# EAGLE design Geoffrey's Holiday Ornament Design (EAGLE 8.4.0)
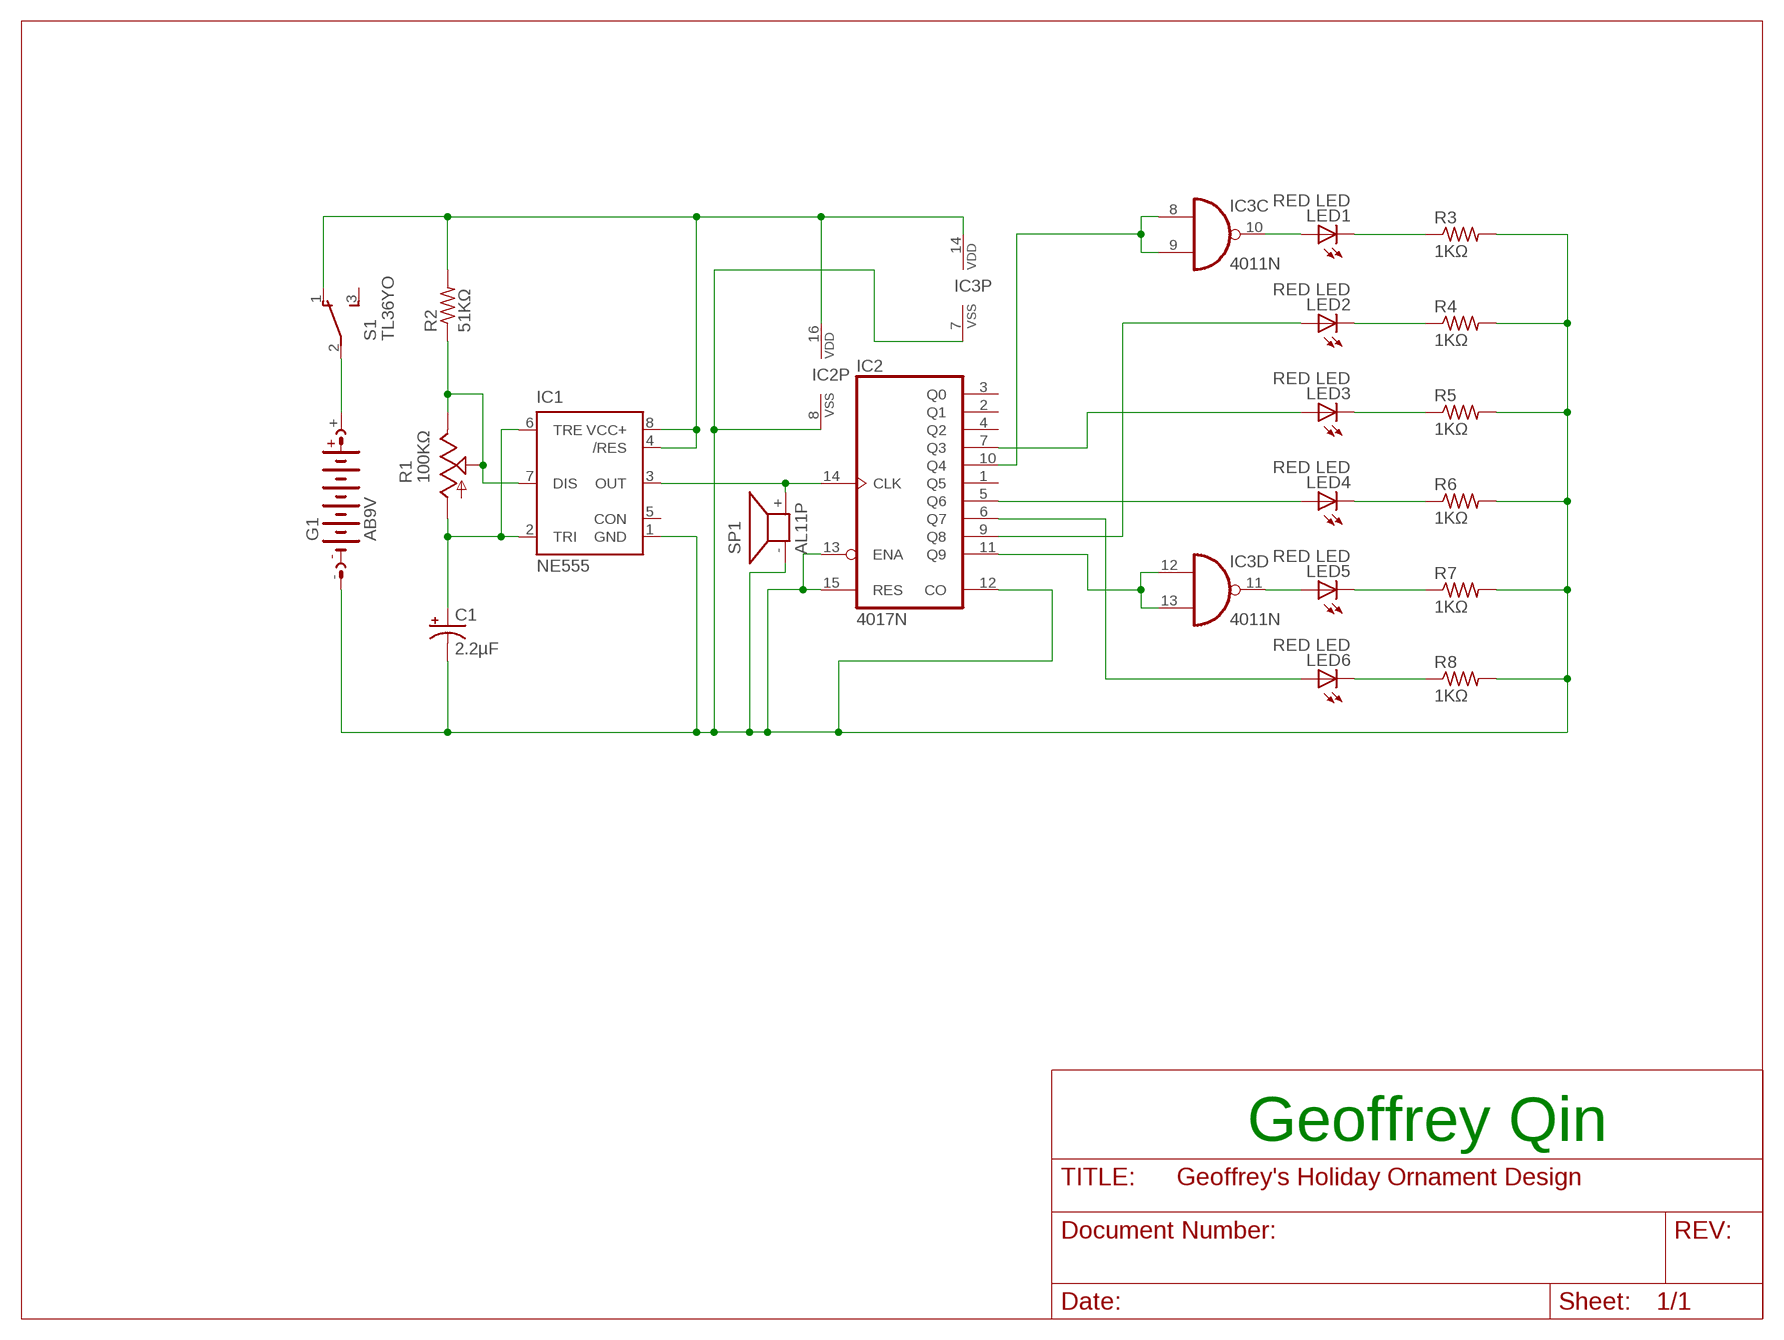
[diagram p0: schematic, sheet 1]

## Parts
C1  2.2µF  CPOL-USE2.5-5  [E2,5-5]
G1  AB9V  [AB9V]
IC1  NE555  [DIL-08]
IC2  4017N  [DIL16]
IC3  4011N  [DIL14]
LED1  RED LED  LED5MM  [LED5MM]
LED2  RED LED  LED5MM  [LED5MM]
LED3  RED LED  LED5MM  [LED5MM]
LED4  RED LED  LED5MM  [LED5MM]
LED5  RED LED  LED5MM  [LED5MM]
LED6  RED LED  LED5MM  [LED5MM]
R1  100KΩ  TRIM_US-CA9V  [CA9V]
R2  51KΩ  R-US_0207/10  [0207/10]
R3  1KΩ  R-US_0207/10  [0207/10]
R4  1KΩ  R-US_0207/10  [0207/10]
R5  1KΩ  R-US_0207/10  [0207/10]
R6  1KΩ  R-US_0207/10  [0207/10]
R7  1KΩ  R-US_0207/10  [0207/10]
R8  1KΩ  R-US_0207/10  [0207/10]
S1  TL36YO  [TL3XYO]
SP1  AL11P  [AL11P]

## Nets
N$1: IC3.11(D:O) LED5.A
N$2: IC1.7(DIS) R1.E R1.S R2.1
N$3: C1.- G1.- IC1.1(GND) IC2.8(VSS) IC2.12(CO) IC2.13(ENA) IC2.15(RES) IC3.7(P:VSS) R3.2 R4.2 R5.2 R6.2 R7.2 R8.2 SP1.-
N$4: LED6.K(C) R8.1
N$5: LED5.K(C) R7.1
N$6: IC1.3(OUT) IC2.14(CLK) SP1.+
N$7: IC1.4(/RES) IC1.8(VCC+) IC2.16(VDD) IC3.14(P:VDD) R2.2 S1.1(O)
N$9: IC2.5(Q6) LED4.A
N$10: IC2.9(Q8) LED2.A
N$12: IC2.6(Q7) LED6.A
N$13: G1.+ S1.2(P)
N$15: IC3.10(C:O) LED1.A
N$17: C1.+ IC1.2(TRI) IC1.6(TRE) R1.A
N$18: IC2.10(Q4) IC3.8(C:I0) IC3.9(C:I1)
N$19: LED4.K(C) R6.1
N$20: LED3.K(C) R5.1
N$21: LED2.K(C) R4.1
N$22: LED1.K(C) R3.1
N$24: IC2.7(Q3) LED3.A
N$25: IC2.11(Q9) IC3.12(D:I0) IC3.13(D:I1)
Unconnected: IC1.5(CON) IC2.1(Q5) IC2.2(Q1) IC2.3(Q0) IC2.4(Q2) IC3.1(A:I0) IC3.2(A:I1) IC3.3(A:O) IC3.4(B:O) IC3.5(B:I0) IC3.6(B:I1) S1.3(S)

## Notes on the sheet
- Geoffrey Qin

## Library data of the parts
C1 = 00Mulock(Updated):CPOL-US: POLARIZED CAPACITOR, American symbol
G1 = 00Mulock(Updated):AB9V: 9-V BATTERY CLIP
IC1 = 00Mulock(Updated):NE555: General purpose bipolar Timer; MF: Arrow Electronics; MPN: NE555N; OC_FARNELL: 1467742; OC_NEWARK: 89K1486
IC2 = 00Mulock(Updated):4017: COUNTER/DIVIDER
IC3 = 00Mulock(Updated):4011: Quad 2-input NAND
LED1-LED6 = 00Mulock(Updated):LED: LED OSRAM: - CHIPLED LG R971, LG N971, LY N971, LG Q971, LY Q971, LO R971, LY R971 LH N974, LH R974 LS Q976, LO Q976, LY Q976 LO Q996 - Hyper CHIPLED LW Q18S LB Q993, LB Q99A, LB R99A - SideLED LS A670, LO A670, LY A670, LG A670, LP A670 LB A673, LV A673, LT A673, LW A673 LH A674 LY A675 LS A676, LA A676, LO A676, LY A676, LW A676 LS A679, LY A679, LG A679 - Hyper Micro SIDELED® LS Y876, LA Y876, LO Y876, LY Y876 LT Y87S - SmartLED LW L88C, LW L88S LB L89C, LB L89S, LG L890 LS L89K, LO L89K, LY L89K LS L896, LA L896, LO L896, LY L896 - TOPLED LS T670, LO T670, LY T670, LG T670, LP T670 LSG T670, LSP T670, LSY T670, LOP T670, LYG T670 LG T671, LOG T671, LSG T671 LB T673, LV T673, LT T673, LW T673 LH T674 LS T676, LA T676, LO T676, LY T676, LB T676, LH T676, LSB T676, LW T676 LB T67C, LV T67C, LT T67C, LS T67K, LO T67K, LY T67K, LW E67C LS E67B, LA E67B, LO E67B, LY E67B, LB E67C, LV E67C, LT E67C LW T67C LS T679, LY T679, LG T679 LS T770, LO T770, LY T770, LG T770, LP T770 LB T773, LV T773, LT T773, LW T773 LH T774 LS E675, LA E675, LY E675, LS T675 LS T776, LA T776, LO T776, LY T776, LB T776 LHGB T686 LT T68C, LB T68C - Hyper Mini TOPLED® LB M676 - Mini TOPLED Santana® LG M470 LS M47K, LO M47K, LY M47K Source: http://www.osram.convergy.de LUXEON: - LUMILED® LXK2-PW12-R00, LXK2-PW12-S00, LXK2-PW14-U00, LXK2-PW14-V00 LXK2-PM12-R00, LXK2-PM12-S00, LXK2-PM14-U00 LXK2-PE12-Q00, LXK2-PE12-R00, LXK2-PE12-S00, LXK2-PE14-T00, LXK2-PE14-U00 LXK2-PB12-K00, LXK2-PB12-L00, LXK2-PB12-M00, LXK2-PB14-N00, LXK2-PB14-P00, LXK2-PB14-Q00 LXK2-PR12-L00, LXK2-PR12-M00, LXK2-PR14-Q00, LXK2-PR14-R00 LXK2-PD12-Q00, LXK2-PD12-R00, LXK2-PD12-S00 LXK2-PH12-R00, LXK2-PH12-S00 LXK2-PL12-P00, LXK2-PL12-Q00, LXK2-PL12-R00 Source: www.luxeon.com KINGBRIGHT: KA-3528ASYC Source: www.kingbright.com
R1 = 00Mulock(Fixed):TRIM_US-: POTENTIOMETER
R2-R8 = 00Mulock(Updated):R-US_: RESISTOR, American symbol
S1 = 00Mulock(Updated):TL36YO: TINY SWITCH ON - ON Source: http://www2.produktinfo.conrad.com/datenblaetter/700000-724999/705152-da-01-de-Subminiaturschalter_TL_36YO.pdf
SP1 = 00Mulock(Fixed):AL11P: SPEAKER Source: Buerklin; OC_FARNELL: unknown; OC_NEWARK: unknown

## Board
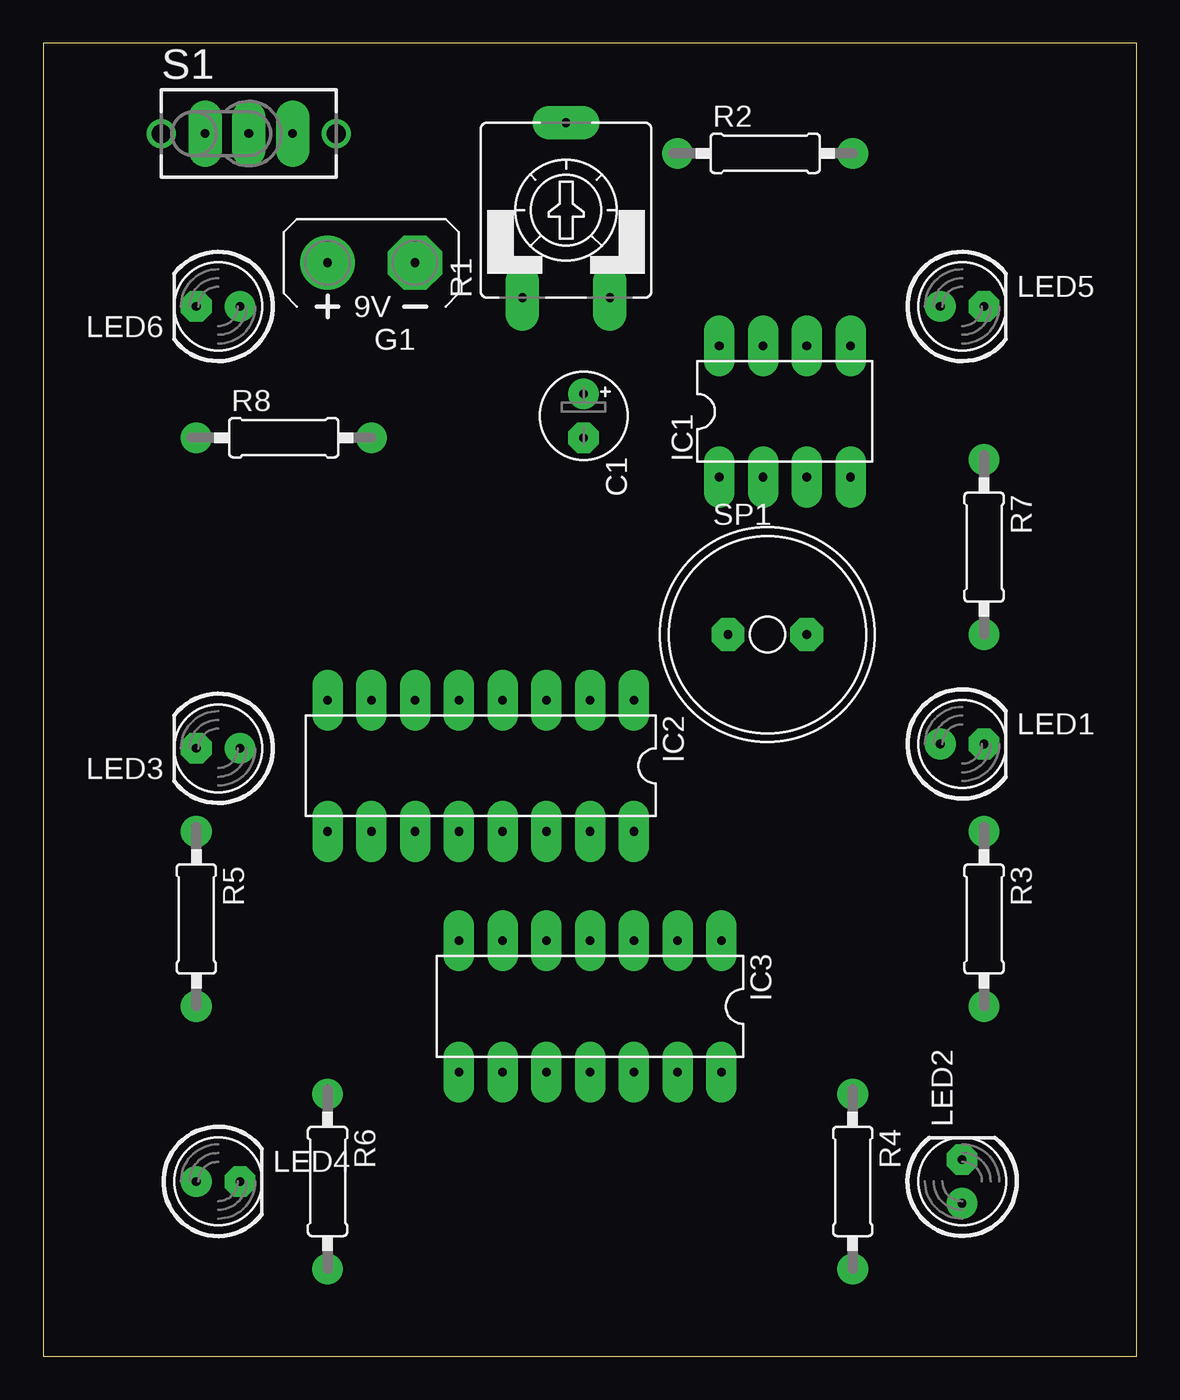
[diagram p1: board, top side]
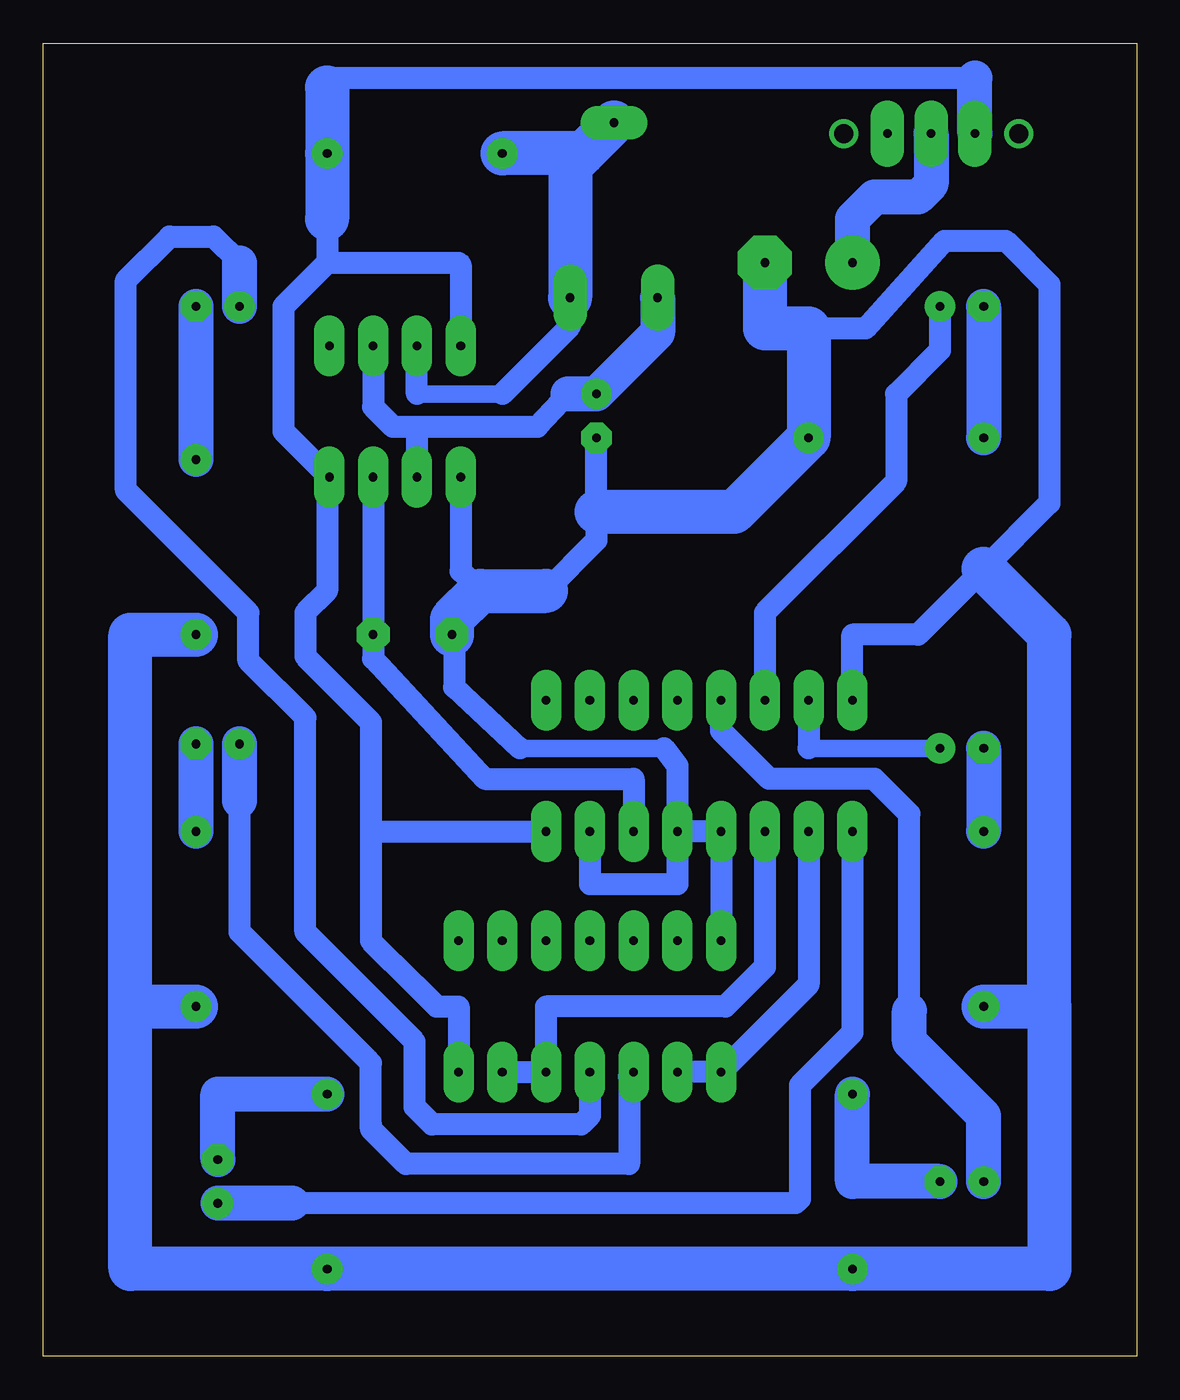
[diagram p2: board, bottom side, seen from below]

Size 63.48 x 76.25 mm. Coordinates in mm from the lower left corner, seen from the top.
Outline: 0,0 63.48,0 63.48,76.25 0,76.25 0,0
Copper layers (1*16): Top 0.035mm / dielectric 1.5mm / Bottom 0.035mm
Design rules "default *": minimum track width 6mil, minimum drill 0.35mm, track to track 20mil, track to pad 20mil, pad to pad 20mil, via to via 20mil, smd to smd 6mil, copper to edge 40mil, drill to drill 6mil, minimum pad ring 10mil, minimum via ring 8mil, stop-mask expansion 4mil, vias tented up to drill 0mil, thermal gap 10mil

### Footprints (pad centres in the part's own frame; a part is rotated, then mirrored left to right if it is on the bottom)
E2,5-5 = drill 0.5 pad 1.778: + -1.27,0 | drill 0.5 pad 1.778 octagon: - 1.27,0
AB9V = drill 0.5 pad 3.15: + 0,2.54 | drill 0.5 pad 3.15 octagon: - 0,-2.54
DIL-08 = drill 0.5 pad 1.778 long: 1 -3.81,-3.81; 2 -1.27,-3.81; 3 1.27,-3.81; 4 3.81,-3.81; 5 3.81,3.81; 6 1.27,3.81; 7 -1.27,3.81; 8 -3.81,3.81
DIL16 = drill 0.5 pad 1.778 long: 1 -8.89,-3.81; 2 -6.35,-3.81; 3 -3.81,-3.81; 4 -1.27,-3.81; 5 1.27,-3.81; 6 3.81,-3.81; 7 6.35,-3.81; 8 8.89,-3.81; 9 8.89,3.81; 10 6.35,3.81; 11 3.81,3.81; 12 1.27,3.81; 13 -1.27,3.81; 14 -3.81,3.81; 15 -6.35,3.81; 16 -8.89,3.81
DIL14 = drill 0.5 pad 1.778 long: 1 -7.62,-3.81; 2 -5.08,-3.81; 3 -2.54,-3.81; 4 0,-3.81; 5 2.54,-3.81; 6 5.08,-3.81; 7 7.62,-3.81; 8 7.62,3.81; 9 5.08,3.81; 10 2.54,3.81; 11 0,3.81; 12 -2.54,3.81; 13 -5.08,3.81; 14 -7.62,3.81
LED5MM = drill 0.5 pad 1.778: A -1.27,0 | drill 0.5 pad 1.778 octagon: K 1.27,0
CA9V = drill 0.5 pad 1.93 long: A -2.54,-5.08; E 2.54,-5.08; S 0,5.08
0207/10 = drill 0.5 pad 1.778: 1 -5.08,0; 2 5.08,0
TL3XYO = drill 0.5 pad 1.93 long: 1 -2.54,0; 2 0,0; 3 2.54,0 | drill 1.1 pad 1.676: M1 -5.08,0; M2 5.08,0
AL11P = drill 0.5 pad 1.905 octagon: + 2.286,0; - -2.286,0

### Placement (x,y rotation side)
C1  31.37,54.61 270 top
G1  19.05,63.5 90 top
IC1  43.05,54.86 0 top
IC2  25.4,34.29 180 top
IC3  31.75,20.32 180 top
LED1  53.34,35.56 0 top
LED2  53.34,10.16 90 top
LED3  10.16,35.31 180 top
LED4  10.16,10.16 0 top
LED5  53.34,60.96 0 top
LED6  10.16,60.96 180 top
R1  30.35,66.55 0 top
R2  41.91,69.85 0 top
R3  54.61,25.4 270 top
R4  46.99,10.16 270 top
R5  8.89,25.4 270 top
R6  16.51,10.16 270 top
R7  54.61,46.99 270 top
R8  13.97,53.34 0 top
S1  11.94,70.99 0 top
SP1  42.04,41.91 0 top

### Tracks (layer width: path | path; a pad name or v marks a point on that pad's centre or on a via)
N$1
  Bottom 1.27: IC3.11 31.75,13.97 32.26,13.46 40.89,13.46 41.91,14.48 41.91,18.29 48.26,24.64 48.26,37.08 51.56,40.39 51.56,43.18 58.67,50.29 58.67,62.48 56.13,65.02 53.59,65.02 52.07,63.5 52.07,63.25
  Bottom 2.032: LED5.A 52.07,63.5
N$2
  Bottom 1.016: 36.83,55.88 41.78,55.88
  Bottom 1.27: 33.15,61.34 33.02,61.34 R1.E 32.89,59.82 36.83,55.88 | 41.78,55.88 IC1.7
  Bottom 2.54: R1.S 32.13,69.85 | 32.13,69.85 R2.1 | 32.13,69.85 32.89,69.09 R1.E
N$3
  Bottom 1.016: 35.81,35.31 27.43,35.31
  Bottom 1.27: 19.05,59.69 15.75,59.69 11.18,64.77 7.62,64.77 5.08,62.23 5.08,49.53 8.89,45.72 12.7,41.91 16.51,41.91 IC2.8 | C1.- 31.37,49.02 31.37,47.37 34.29,44.45 | IC1.1 39.24,45.59 38.1,44.45 | IC2.15 31.75,27.43 26.67,27.43 IC2.13 | IC2.13 IC2.12 IC3.7 | SP1.- 39.62,41.78 39.62,38.86 35.81,35.31 | 27.43,35.31 26.67,34.29 IC2.13
  Bottom 2.54: G1.- 21.59,59.69 19.05,59.69 R8.2 23.37,49.02 31.37,49.02 | 34.29,44.45 38.1,44.45 39.75,42.8 SP1.- | R5.2 5.08,20.32 | 5.08,20.32 5.08,5.08 R6.2 R4.2 58.42,5.08 58.42,20.32 | 58.42,20.32 R3.2 | 58.42,20.32 58.42,41.91 R7.2 | 5.08,20.32 5.08,41.91 8.89,45.72
N$4
  Bottom 2.032: LED6.K R8.1
N$5
  Bottom 2.032: LED5.K R7.1
N$6
  Bottom 1.27: IC1.3 SP1.+ 44.32,40.51 37.85,33.53 29.21,33.53 IC2.14
N$7
  Bottom 1.27: 9.4,74.22 46.43,74.22 46.99,73.66 | 46.99,66.04 46.99,63.5 | 46.99,63.5 49.53,60.96 49.53,53.72 IC1.4 46.99,50.93 46.99,44.45 48.26,43.18 48.26,40.64 44.45,36.83 44.45,30.48 | 46.99,63.5 39.37,63.5 39.24,63.37 IC1.8 | 44.45,30.48 IC2.16 | 44.45,30.48 44.45,24.13 41.91,21.59 40.64,20.32 39.37,20.32 IC3.14
  Bottom 2.032: S1.1 9.4,74.22
  Bottom 2.54: 46.99,73.66 R2.2 46.99,66.04
N$9
  Bottom 1.27: 13.21,20.07 13.21,31.5 15.24,33.53 21.34,33.53 24.13,36.32 IC2.5
  Bottom 2.032: LED4.A 8.89,13.97 13.21,18.29 13.21,20.07
N$10
  Bottom 1.27: IC2.9 16.51,18.8 19.56,15.75 19.56,9.14 19.81,8.89 49.02,8.89
  Bottom 2.032: 49.02,8.89 LED2.A
N$12
  Bottom 1.27: LED6.A 11.43,58.42 13.97,55.88 13.97,50.8 21.59,43.18 IC2.6
N$13
  Bottom 2.032: S1.2 11.94,68.07 12.7,67.31 15.24,67.31 16.51,66.04 G1.+
N$15
  Bottom 1.27: IC3.10 29.46,16.26 29.46,11.18 42.42,11.18 44.45,13.21 44.45,13.46 44.45,17.02 44.7,17.27 52.07,24.64 52.07,32.26
  Bottom 2.032: 52.07,32.26 LED1.A
N$17
  Bottom 1.27: 33.02,55.88 34.8,53.98 41.78,53.98 | 41.78,53.98 IC1.2 | IC1.6 44.32,55.12 43.18,53.98 41.78,53.98
  Bottom 2.032: R1.A 27.81,59.44 C1.+ 33.02,55.88
N$18
  Bottom 1.27: IC2.10 19.05,21.59 IC3.8 IC3.9
N$19
  Bottom 2.032: LED4.K 16.51,10.16 R6.1
N$20
  Bottom 2.032: LED3.K R5.1
N$21
  Bottom 2.032: LED2.K 53.34,15.24 R4.1
N$22
  Bottom 2.032: LED1.K R3.1
N$24
  Bottom 1.016: 19.05,35.31 LED3.A
  Bottom 1.27: IC2.7 19.05,35.31
N$25
  Bottom 1.27: IC2.11 21.59,22.61 23.88,20.32 34.29,20.32 IC3.12 IC3.13